# Altium schematic sheet prec_3V_LDO.SchDoc
size A4; Organization: Altium Limited; Address1: L3, 12a Rodborough Rd; Address2: Frenchs Forest; Address3: NSW; Address4: Australia 2086; DocumentNumber: 8; SheetNumber: 8; SheetTotal: 19
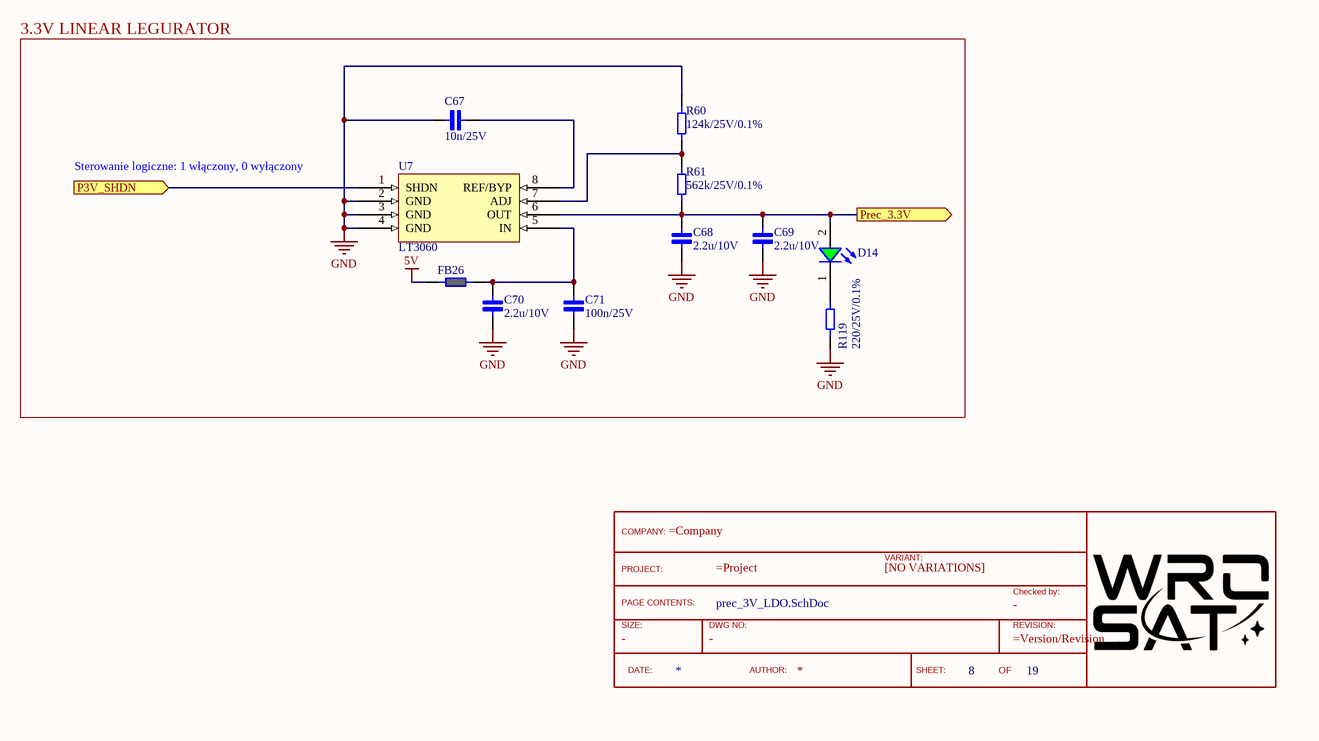
[diagram p0: prec_3V_LDO.SchDoc]

## Parts
?  TitleBlock  (value not drawn)  (graphical)
C67  10n/25V  [Cap_0402]
C68  2.2u/10V  [Cap_0402]
C69  2.2u/10V  [Cap_0402]
C70  2.2u/10V  [Cap_0402]
C71  100n/25V  [Cap_0402]
D14  Green, 3.2V  [WL-SMCW_0603_H=0.7mm]  (value not drawn)
FB26  Ferrite_bead_0402  [FERRITE_0402]  (value not drawn)
R60  124k/25V/0.1%  [RES_0402]
R61  562k/25V/0.1%  [RES_0402]
R119  220/25V/0.1%  [RES_0402]
U7  LT3060  [TS8]

## Blocks framed on the sheet
3.3V LINEAR LEGURATOR: C67-C71 D14 FB26 R60 R61 R119 U7

## Ports
P3V_SHDN (in), Prec_3.3V (out)

## Nets
5V: FB26.1
GND: C67.1 C68.1 C69.1 C70.1 C71.1 R60.2 R119.1 U7.2(GND) U7.3(GND) U7.4(GND)
P3V_SHDN: U7.1(SHDN) ; port P3V_SHDN
Prec_3.3V: C68.2 C69.2 D14.2(A) R61.1 U7.6(OUT) ; port Prec_3.3V
NetC67_2: C67.2 U7.8(REF/BYP)
NetC70_2: C70.2 C71.2 FB26.2 U7.5(IN)
NetD14_1: D14.1(K) R119.2
NetR60_1: R60.1 R61.2 U7.7(ADJ)

## Notes on the sheet
- Sterowanie logiczne: 1 włączony, 0 wyłączony
- Title
- Size:
- Date:
- A3
- Number:
- Time:
- Revision:
- Sheet
- of
- File:
- (in symbol TitleBlock) COMPANY:; VARIANT:; PROJECT:; [NO VARIATIONS]; Checked by:; PAGE CONTENTS:; SIZE:; DWG NO:; REVISION:; DATE:; AUTHOR:; SHEET:; OF

## Library data of the parts
? = TitleBlock: Standard TitleBlock; DrawingNo: -; Size: -; Checked: -
C67 = Cap_0402_10n: Ceramic Capacitor 10n / 0402 / 25V / ±5%, Wurth Elektronik MLCC; ComponentLink1Description: New link; ComponentLink1URL: https://www.we-online.com/catalog/en/WCAP-CSGP-25VDC
C68-C70 = Cap_0402_2.2u: Ceramic Capacitor 2.2uF / 0402 / 10V / ±5%, Wurth Elektronik MLCC
C71 = Cap_0402_100n: Ceramic Capacitor 100n / 0402 / 25V / ±5%, Wurth Elektronik MLCC; ComponentLink1Description: New link; ComponentLink1URL: https://www.we-online.com/catalog/en/WCAP-CSGP-25VDC
D14 = 150060GS75000: WL-SMCW SMT Mono-color Chip LED Waterclear, size 0603, Green, 3.2V, 140deg; Chip Technology: InGaN; Dominant Wavelength typ.: 525nm; Luminous Intensity typ.: 430mcd; Peak Wavelength typ.: 515nm; Viewing Angle: 140deg; ComponentLink1Description: Manufacturer; ComponentLink1URL: http://www.we-online.de; ComponentLink2URL: https://www.we-online.com/catalog/datasheet/150060GS75000.pdf; ComponentLink2Description: Datasheet; Forward Voltage typ.: 3.2V; Emitting Color: Green; Mounting Technology: SMT; Operating Temperature: -40 to +85degC; Published Date: December 2019; Part Number: 150060GS75000; Packaging: Tape and Reel; Size: 0603; Publisher: Wurth Elektronik
FB26 = Ferrite_bead_0402: Ferrite bead, wurth 74269241102
R60 = Res_0402_124k: Vishay, thin film resistor 124k/25V/0.1%
R61 = Res_0402_562k: Vishay, thin film resistor 562k/25V/0.1%
R119 = Res_0402_1: Vishay, thin film resistor 1/25V/0.1%
U7 = Lt3060: 45V VIN, Micropower, / Low Noise, 100mA Low / Dropout, Linear Regulator